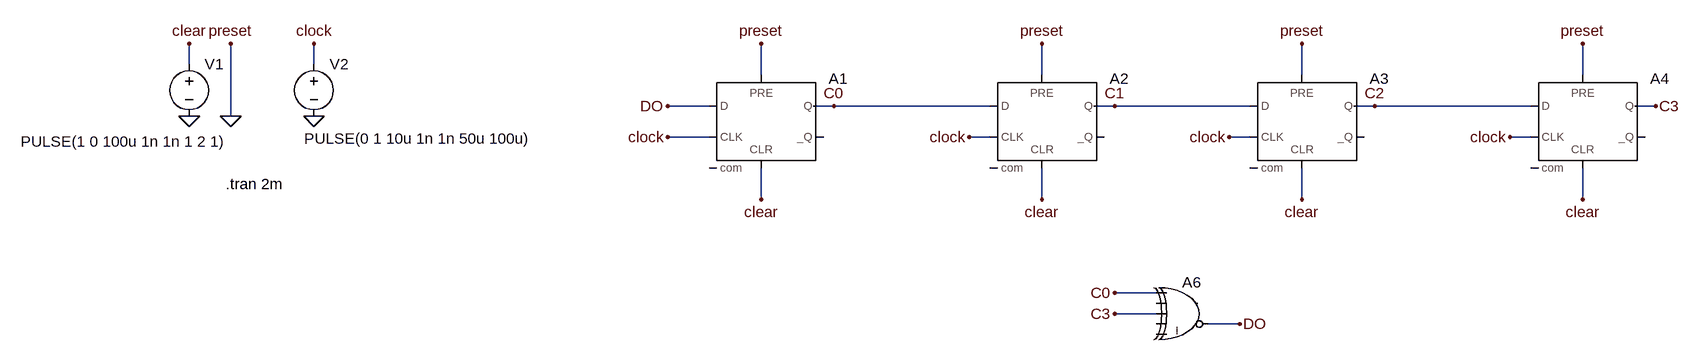
[diagram p0: schematic 1c.asc]
1c.asc, the LTspice schematic file:
Version 4
SHEET 1 1620 680
WIRE -688 96 -688 64
WIRE -496 96 -496 64
WIRE 192 112 192 64
WIRE 624 112 624 64
WIRE 1024 112 1024 64
WIRE 1456 112 1456 64
WIRE 112 160 48 160
WIRE 304 160 272 160
WIRE 544 160 304 160
WIRE 736 160 704 160
WIRE 944 160 736 160
WIRE 1136 160 1104 160
WIRE 1376 160 1136 160
WIRE 1568 160 1536 160
WIRE -624 176 -624 64
WIRE 112 208 48 208
WIRE 544 208 512 208
WIRE 944 208 912 208
WIRE 1376 208 1344 208
WIRE 192 304 192 256
WIRE 624 304 624 256
WIRE 1024 304 1024 256
WIRE 1456 304 1456 256
WIRE 800 448 736 448
WIRE 800 480 736 480
WIRE 928 496 880 496
FLAG 192 64 preset
FLAG 304 160 C0
FLAG 624 64 preset
FLAG 736 160 C1
FLAG 1024 64 preset
FLAG 1136 160 C2
FLAG 1456 64 preset
FLAG 1568 160 C3
FLAG 192 304 clear
FLAG 624 304 clear
FLAG 1024 304 clear
FLAG 1456 304 clear
FLAG -688 64 clear
FLAG 736 448 C0
FLAG 736 480 C3
FLAG -624 176 0
FLAG -496 176 0
FLAG -624 64 preset
FLAG -496 64 clock
FLAG 48 208 clock
FLAG -688 176 0
FLAG 928 496 DO
FLAG 48 160 DO
FLAG 512 208 clock
FLAG 912 208 clock
FLAG 1344 208 clock
SYMBOL Digital\\dflop 192 112 R0
SYMATTR InstName A1
SYMATTR SpiceLine Td=30n Trise=1n
SYMBOL Digital\\dflop 624 112 R0
SYMATTR InstName A2
SYMATTR SpiceLine Td=30n Trise=1n
SYMBOL Digital\\dflop 1024 112 R0
SYMATTR InstName A3
SYMATTR SpiceLine Td=30n Trise=1n
SYMBOL Digital\\dflop 1456 112 R0
SYMATTR InstName A4
SYMATTR SpiceLine Td=30n Trise=1n
SYMBOL voltage -496 80 R0
WINDOW 3 -15 130 Left 2
WINDOW 123 0 0 Left 0
WINDOW 39 0 0 Left 0
SYMATTR Value PULSE(0 1 10u 1n 1n 50u 100u)
SYMATTR InstName V2
SYMBOL Digital\\xor 848 416 R0
SYMATTR InstName A6
SYMBOL voltage -688 80 R0
WINDOW 3 -259 135 Left 2
WINDOW 123 0 0 Left 0
WINDOW 39 0 0 Left 0
SYMATTR Value PULSE(1 0 100u 1n 1n 1 2 1)
SYMATTR InstName V1
TEXT -632 280 Left 2 !.tran 2m

The netlist it stands for:
* 1c.asc
A1 DO 0 clock 0 clear 0 C0 0 DFLOP Td=30n Trise=1n
A2 C0 0 clock 0 clear 0 C1 0 DFLOP Td=30n Trise=1n
A3 C1 0 clock 0 clear 0 C2 0 DFLOP Td=30n Trise=1n
A4 C2 0 clock 0 clear 0 C3 0 DFLOP Td=30n Trise=1n
V2 clock 0 PULSE(0 1 10u 1n 1n 50u 100u)
A6 C0 0 C3 0 0 DO 0 0 XOR
V1 clear 0 PULSE(1 0 100u 1n 1n 1 2 1)
.tran 2m
.backanno
.end

* Results of the author's LTspice run, read from the files saved beside the schematic
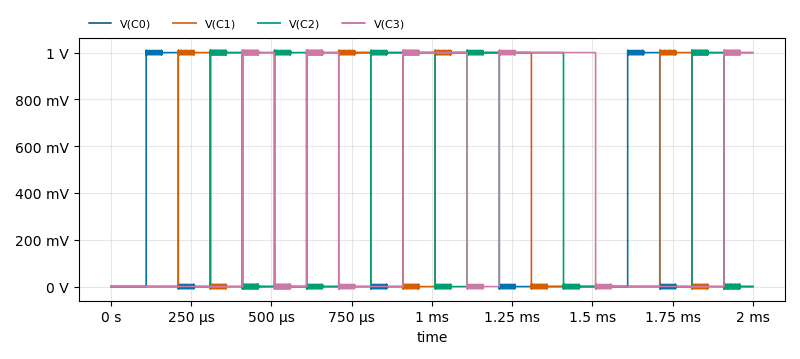
[diagram p1: Transient Analysis of 1c.asc, plotted from the saved traces]
* Transient Analysis, 1 run:
*   V(C0): min -9.577 mV, max 1.01 V, average 450 mV, rms 670.8 mV, last 0 V
*   V(C1): min -9.577 mV, max 1.01 V, average 445 mV, rms 667.1 mV, last 1 V
*   V(C2): min -9.577 mV, max 1.01 V, average 400 mV, rms 632.5 mV, last 0 V
*   V(C3): min -9.577 mV, max 1.01 V, average 395 mV, rms 628.5 mV, last 1 V